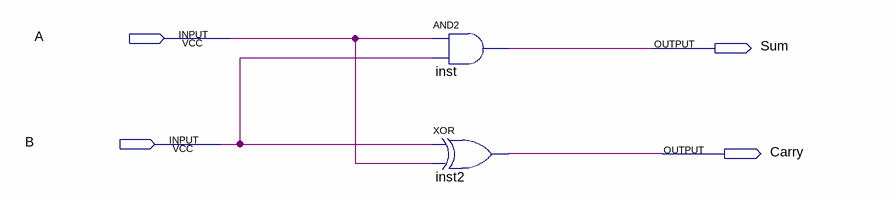
[diagram p0: schematic sheet]
// Quartus schematic halfadder.bdf as structural Verilog: 2 symbols, 4 pins
module halfadder (
  input  A,
  input  B,
  output Sum,
  output Carry
);

  and inst (Sum, A, B);
  xor inst2 (Carry, B, A);
endmodule
